# EAGLE design Adafruit-2.2-SPI-TFT-v0.2 (EAGLE 5.12)
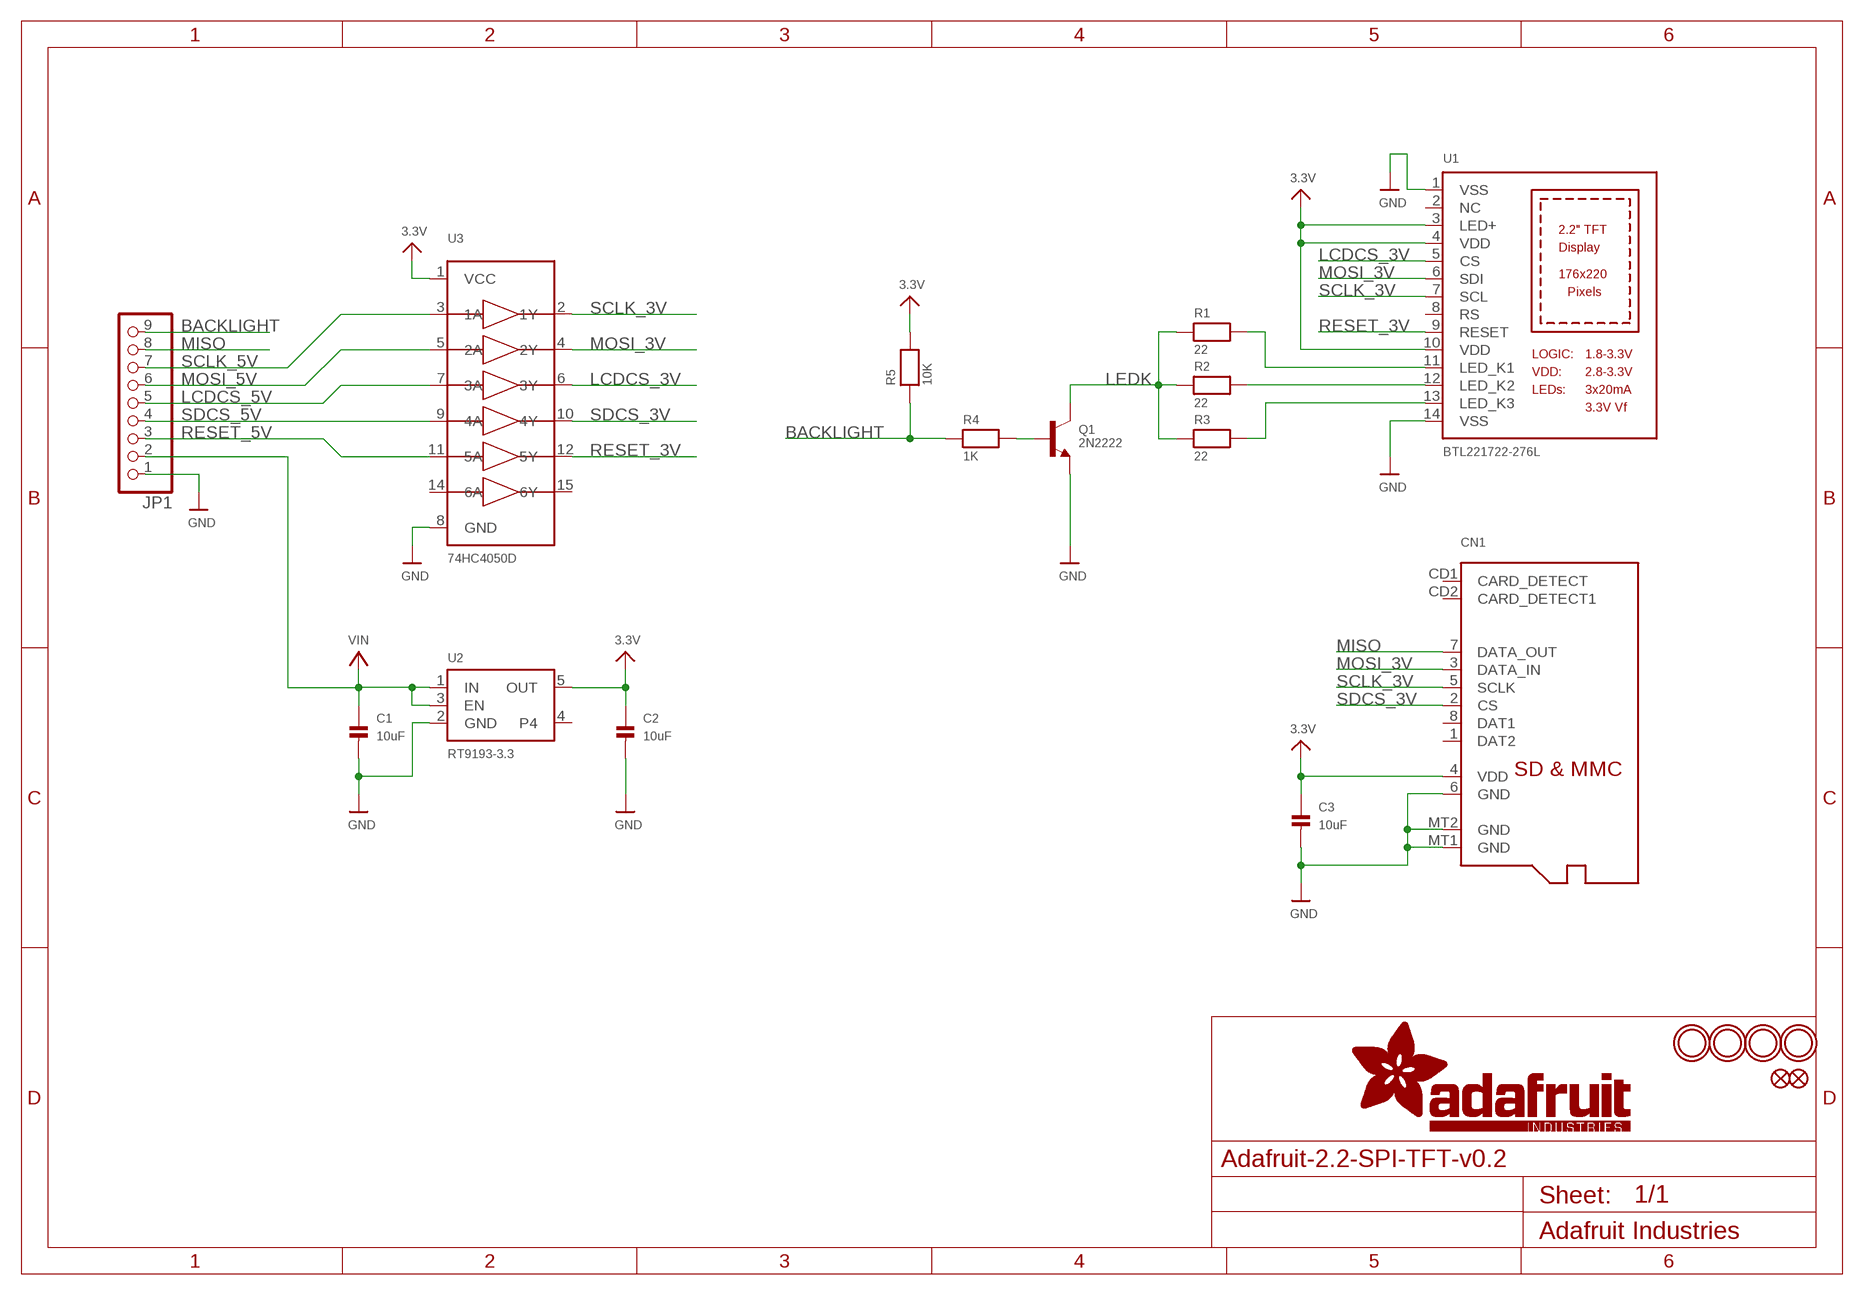
[diagram p0: schematic, sheet 1]

## Parts
C1  10uF  CAP_CERAMIC0805  [0805]
C2  10uF  CAP_CERAMIC0805  [0805]
C3  10uF  CAP_CERAMIC0805  [0805]
CN1  MICROSD  [MICROSD]
FID1  FIDUCIAL""  [FIDUCIAL_1MM]
FID2  FIDUCIAL""  [FIDUCIAL_1MM]
JP1  HEADER-1X970MIL  [1X09_ROUND_70]
Q1  2N2222  TRANSISTOR_NPNWIDE  [SOT23-WIDE]
R1  22  RESISTOR0805  [0805]
R2  22  RESISTOR0805  [0805]
R3  22  RESISTOR0805  [0805]
R4  1K  RESISTOR0805  [0805]
R5  10K  RESISTOR0805  [0805]
U1  BTL221722-276L  DISP_LCD_BTL221722-276L  [BTL221722-276L]
U2  RT9193-3.3  VREG_SOT23-5  [SOT23-5]
U3  74HC4050D  [SOIC16]
U$2  MOUNTINGHOLE2.5  [MOUNTINGHOLE_2.5_PLATED]
U$3  MOUNTINGHOLE2.5  [MOUNTINGHOLE_2.5_PLATED]
U$4  MOUNTINGHOLE2.5  [MOUNTINGHOLE_2.5_PLATED]
U$5  MOUNTINGHOLE2.5  [MOUNTINGHOLE_2.5_PLATED]

## Nets
3.3V: C2.1 C3.1 CN1.4(VDD) R5.2 U1.3(LED+) U1.4(VDD) U1.10(VDD) U2.5(OUT) U3.1(VCC)
BACKLIGHT: JP1.9 R4.1 R5.1
GND: C1.2 C2.2 C3.2 CN1.6(GND) CN1.MT1(GND) CN1.MT2(GND) JP1.1 Q1.2(E) U1.1(VSS) U1.14(VSS) U2.2(GND) U3.8(GND)
LCDCS_3V: U1.5(CS) U3.6(3Y)
LCDCS_5V: JP1.5 U3.7(3A)
LEDK: Q1.3(C) R1.1 R2.1 R3.1
MISO: CN1.7(DATA_OUT) JP1.8
MOSI_3V: CN1.3(DATA_IN) U1.6(SDI) U3.4(2Y)
MOSI_5V: JP1.6 U3.5(2A)
N$1: R1.2 U1.11(LED_K1)
N$2: R2.2 U1.12(LED_K2)
N$3: R3.2 U1.13(LED_K3)
N$4: Q1.1(B) R4.2
RESET_3V: U1.9(RESET) U3.12(5Y)
RESET_5V: JP1.3 U3.11(5A)
SCLK_3V: CN1.5(SCLK) U1.7(SCL) U3.2(1Y)
SCLK_5V: JP1.7 U3.3(1A)
SDCS_3V: CN1.2(CS) U3.10(4Y)
SDCS_5V: JP1.4 U3.9(4A)
VIN: C1.1 JP1.2 U2.1(IN) U2.3(EN)
Unconnected: CN1.1(DAT2) CN1.8(DAT1) CN1.CD1(CARD_DETECT) CN1.CD2(CARD_DETECT1) U1.2(NC) U1.8(RS) U2.4 U3.14(6A) U3.15(6Y)

## Library data of the parts
C1-C3 = microbuilder:CAP_CERAMIC: Ceramic Capacitors 0402 - 0402 Surface Mount Capacitors 16pF 50V 5% [Digikey: 445-4899-2-ND] 18pF 50V 5% [Digikey: 490-1281-2-ND] 22pF 50V 5% [Digikey: 490-1283-2-ND] 68pF 50V 5% [Digikey: 490-1289-2-ND] 0.1uF 10V 10% [Digikey: 490-1318-2-ND] 1.0uF 6.3V 10% [Digikey: 490-1320-2-ND] 0603 - 0603 Surface Mount Capacitors 16 pF 50V 5% [Digikey: 445-5051-2-ND] 22 pF 50V [Digikey: PCC220ACVTR-ND] 33 pF 50V 5% [Digikey: 490-1415-1-ND] 56pF 50V 5% [Digikey: 490-1421-1-ND] 220pF 50V 5% [Digikey: 445-1285-1-ND] 680 pF 50V 2200 pF 50V 5% C0G [Digikey: 445-1297-1-ND] 5600 pF 100V 5% X7R [Digikey: 478-3711-1-ND] 0.1 µF 25V 10% [Digikey: PCC2277TR-ND] 0.22 µF 16V 10% X7R [Digikey: 445-1318-1-ND] 1.0 µF 25V 10% [Digikey: 445-5146-2-ND] 0603 - RF Specific 3pF 250V +/-0.1pF RF [Digikey: 712-1347-1-ND] 18 pF 250V 5% [Digikey: 478-3505-1-ND or 712-1322-1-ND] 56 pF 250V 5% C0G RF [Digikey: 490-4867-1-ND] 68 pF 250V RF [Digikey: 490-4868-1-ND] 0805 - 0805 Surface Mount Capacitors 220 pF 250V 2% RF Ceramic Capacitor [Digikey: 712-1398-1-ND] 1000 pF 50V 2% NP0 Ceramic Capacitor [Digikey: 478-3760-1-ND] 0.1 µF 25V 10% Ceramic Capacitor [Digikey: PCC1828TR-ND] 1.0 µF 16V 10% Ceramic Capacitor[Digikey: 490-1691-2-ND] 10.0 µF 10V 10% Ceramic Capacitor[Digikey: 709-1228-1-ND] 10.0 uF 16V 10% Ceramic Capacitor [Digikey: 478-5165-2-ND] 47 uF 6.3V 20% Ceramic Capacitor [Digikey: 587-1779-1-ND or 399-5506-1-ND] 1206 - 1206 Surface Mount Capacitors 47uF 10V 20% Ceramic Capacitor [Digikey: 490-5528-1-ND or 399-5508-1-ND or 445-6010-1-ND] 100uF 6.3V -20%, +80% Y5V Ceramic Capacitor (Digikey: 490-4512-1-ND, Mouser: 81-GRM31CF50J107ZE1L)
CN1 = microbuilder:MICROSD: MicroSD/Transflash Card Holder with SPI pinout 3M: 2908-05WB-M6 4UConnector: 19656 Footprint courtesy: Adafruit Industries
FID1 FID2 = microbuilder:FIDUCIAL: Fiducial Alignment Points Various fiducial points for machine vision alignment.
JP1 = microbuilder:HEADER-1X9: PIN HEADER
Q1 = microbuilder:TRANSISTOR_NPN: NPN Transistor Transistor (NPN) 500mA 45V - BC817 [Digikey: 568-1631-1-ND] Transistor (NPN) 500mA 45V - BC817,215 [Mouser: 771-BC817-T/R] SOT23-R - SOT23 footprint optimised for use with solder paste and reflow ovens. SOT23-W - SOT23 footprint optimised for hand-soldering (larger pads).
R1-R5 = microbuilder:RESISTOR: Resistors 0402 - 0402 Surface Mount Package 22 Ohm 1% 1/16W [Digikey: 311-22.0LRTR-ND] 33 Ohm 5% 1/16W 1.0K 5% 1/16W 1.5K 5% 1/16W 2.0K 1% 1/16W 10.0K 1% 1/16W [Digikey: 311-10.0KLRTR-ND] 10.0K 5% 1/16W [Digikey: RMCF0402JT10K0TR-ND] 12.1K 1% 1/16W [Digikey: 311-22.0LRTR-ND] 100.0K 5% 1/16W 0603 - 0603 Surface Mount Package 0 Ohm 1/10 Watt 1% Resistor 15 Ohm 1/10 Watt 1% Resistor 33 Ohm 1/10 Watt 1% Resistor 49.9 Ohm 1/10 Watt 1% Resistor 100 Ohm 1/10 Watt 1% Resistor 150 Ohm 1/10 Watt 1% Resistor 240 Ohm 1/10 Watt 1% Resistor 390 Ohm 1/10 Watt 1% Resistor 560 Ohm 1/10 Watt 1% Resistor 680 Ohm 1/10 Watt 1% Resistor 750 Ohm 1/10 Watt 1% Resistor 1.0K Ohm 1/10 Watt 1% Resistor 1.5K Ohm 1/10 Watt 1% Resistor 2.0K Ohm 1/10 Watt 1% Resistor 2.2K Ohm 1/10 Watt 1% Resistor 3.3K Ohm 1/10 Watt 1% Resistor 4.7K Ohm 1/10 Watt 1% Resistor 10.0K Ohm 1/10 Watt 1% Resistor 12.0K Ohm 1/10 Watt 1% Resistor 12.1K Ohm 1/10 Watt 1% Resistor 20.0K Ohm 1/10 Watt 1% Resistor 33.0K Ohm 1/10 Watt 1% Resistor 100.0K Ohm 1/10 Watt 1% Resistor 0805 - 0805 Surface Mount Package 0 Ohm 1/8 Watt 1% Resistor 33 Ohm 1/8 Watt 1% Resistor 100 Ohm 1/8 Watt 1% Resistor 150 Ohm 1/8 Watt 1% Resistor 200 Ohm 1/8 Watt 1% Resistor 240 Ohm 1/8 Watt 1% Resistor 330 Ohm 1/8 Watt 1% Resistor 390 Ohm 1/8 Watt 1% Resistor 470 Ohm 1/8 Watt 1% Resistor 1.0K Ohm 1/8 Watt 1% Resistor 1.5K Ohm 1/8 Watt 1% Resistor 2.0K Ohm 1/8 Watt 1% Resistor 4.7K Ohm 1/8 Watt 1% Resistor 5.1K Ohm 1/8 Watt 1% Resistor 5.6K Ohm 1/8 Watt 1% Resistor 10.0K Ohm 1/8 Watt 1% Resistor 22.0K Ohm 1/8 Watt 1% Resistor 33.0K Ohm 1/8 Watt 1% Resistor 100K Ohm 1/8 Watt 1% Resistor 1206 - 1206 Surface Mount Package 2012 - 2010 Surface Mount Package 0.11 Ohm 1/2 Watt 1% Resistor - Digikey: RHM.11UCT-ND
U1 = microbuilder:DISP_LCD_BTL221722-276L: BTL221722-276L - 2.2" 176x220 LCD Display - SPI Interface Dimensions: W: 40.3mm, L: 55mm, H: 2.35mm Logic: 1.8-3.3V VDD: 2.8-3.3V LEDs: 3*20mA LED Vf: ~3.3V
U2 = microbuilder:VREG_SOT23-5: SOT23-5 Fixed Voltage Regulators To better organise some of the SOT23-5 fixed voltage regulators in this library, this new part was created. Part Current Out V Out V In V Dropout Digikey Part No. ADP121 150mA 3.3V 3.4-5.5V 0.09V @ 150mA ADP121-AUJZ33R7CT-ND ADP121 150mA 3.0V 3.1-5.5V 0.09V @ 150mA ADP121-AUJZ30R7CT-ND ADP122 300mA 3.3V 3.4-5.5V 0.085V @ 300mA ADP122AUJZ-3.3-R7CT-ND ADP1712 300mA 3.3V 3.5-5.5V 0.17V @ 300mA ADP1712AUJZ-3.3-R7TR-ND AP7311 (Low Cost) 150mA 3.3V 3.5-6V 0.15V @ 150mA AP7311-33WG-7DICT-ND LD39015M18R 150mA 1.8V 1.9V-5.5V 0.08V @ 100mA 497-6977-1-ND MCP1824T-3302E/OT 300mA 3.3V 3.5V-6V 0.2V @ 300mA MCP1824T-3302E/OTCT-ND MIC5205-2.5YM5 TR 150mA 2.5V 2.7-16V 0.165V @ 150mA 576-1257-2-ND MIC5205-3.0YM5 TR 150mA 3.0V 3.2V-16V 0.165V @ 150mA 576-1258-2-ND MIC5205-3.3YM5 TR 150mA 3.3V 3.5V-16V 0.165V @ 150mA 576-1259-2-ND TPS780330220 150mA 3.3V+2.2V 3.6-5.5V 250mV Max 296-23332-1-ND TDA3663/N1,135 100mA 3.3V 3.5-45V 0.18V @ 50mA 568-5343-1-ND
U3 = microbuilder:74HC4050D: 6-channel level shifter 74HC4050D - 2V-6V Supply Digikey: 74HC4050D,653-ND Mouser: 771-74HC4050D-T
U$2-U$5 = microbuilder:MOUNTINGHOLE: Mounting Hole For #2 screws (0.086"/2.18mm width, 0.094"/2.4mm hole) use 2.5mm

## Board
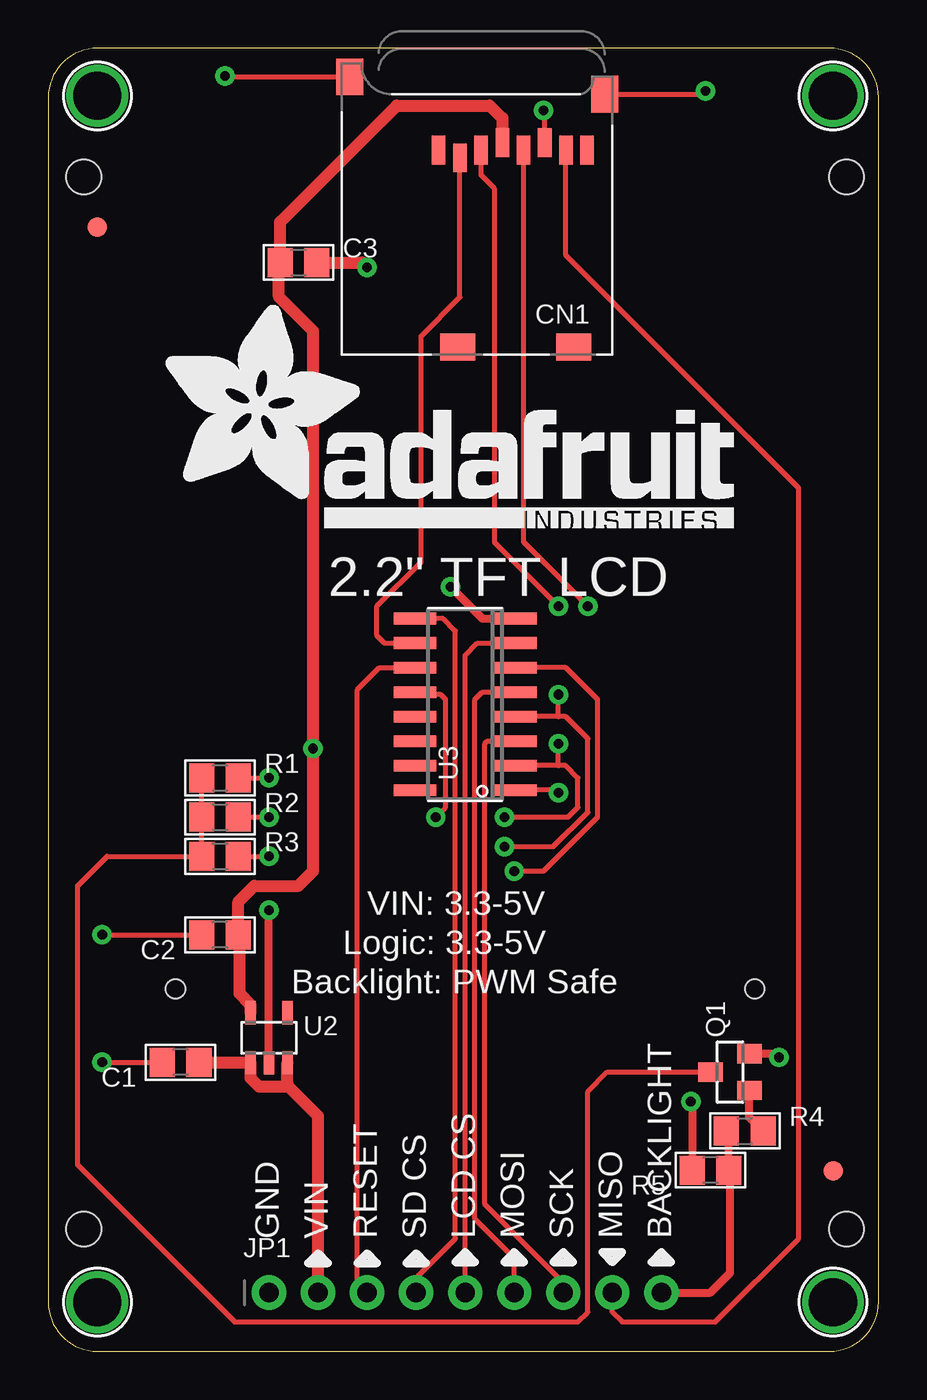
[diagram p1: board, top side]
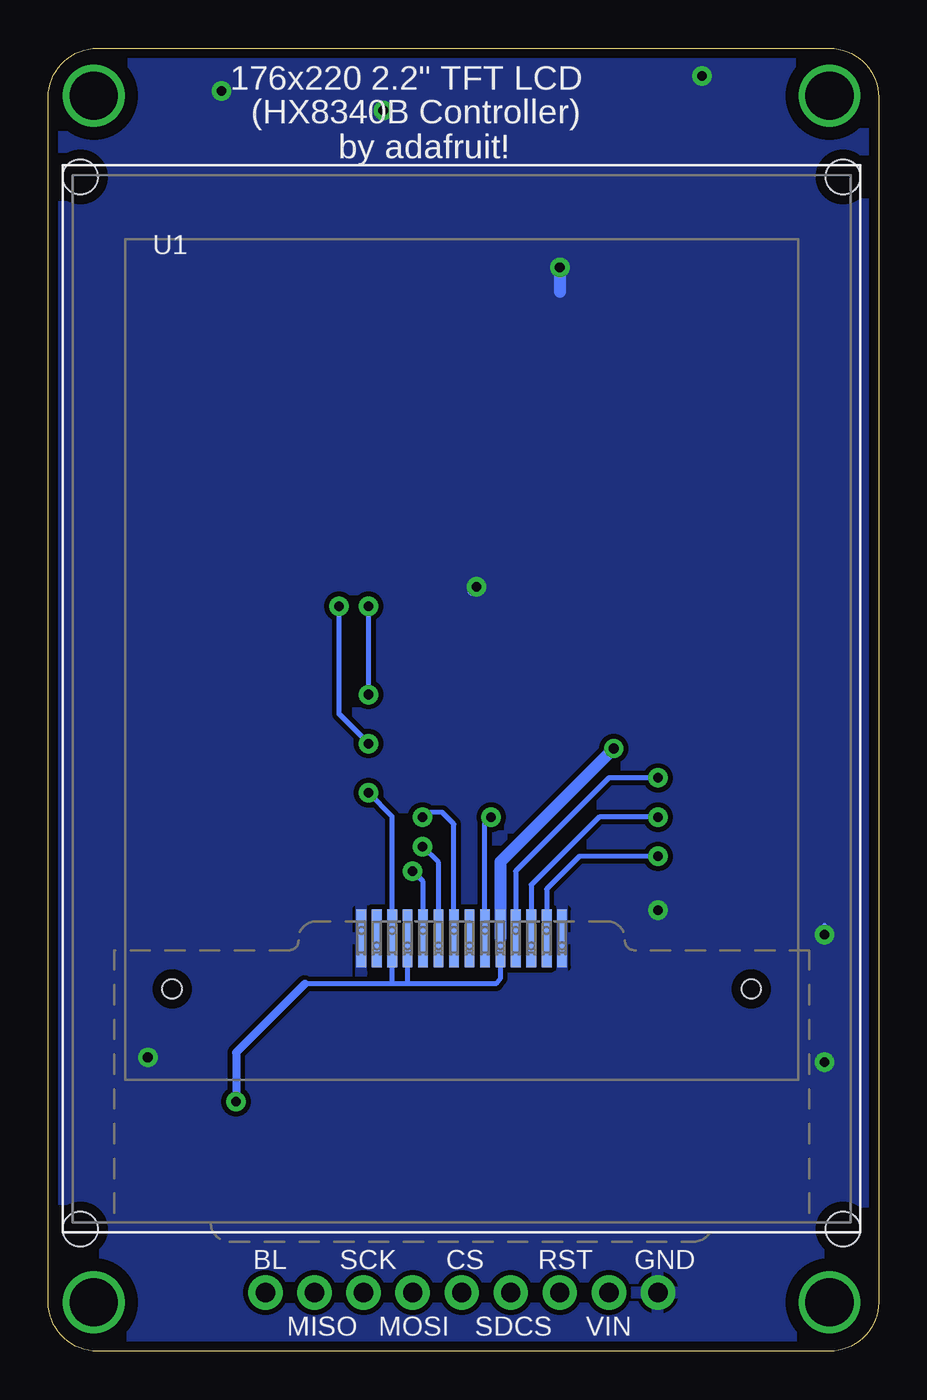
[diagram p2: board, bottom side, seen from below]

Size 43 x 67.5 mm. Coordinates in mm from the lower left corner, seen from the top.
Outline: 0,2.54 arc90 2.54,0 40.46,0 arc90 43,2.54 43,64.96 arc90 40.46,67.5 2.54,67.5 arc90 0,64.96 0,2.54
Copper layers (1*16): Top 0.035mm / dielectric 1.5mm / Bottom 0.035mm
Design rules "PCBCart-Standard": minimum track width 8mil, minimum drill 0.4mm, track to track 8mil, track to pad 8mil, pad to pad 8mil, via to via 8mil, smd to smd 8mil, copper to edge 20mil, drill to drill 8mil, minimum pad ring 8mil, minimum via ring 10mil, stop-mask expansion 3mil, vias tented up to drill 20mil, thermal gap 8mil

### Footprints (pad centres in the part's own frame; a part is rotated, then mirrored left to right if it is on the bottom)
0805 = smd 1.3 x 1.5: 1 -0.95,0; 2 0.95,0
MICROSD = smd 0.7 x 1.5: 1 9,-10.64; 2 7.9,-10.24; 3 6.8,-10.64; 4 5.7,-11.04; 5 4.6,-10.64; 6 3.5,-11.04; 7 2.4,-10.64; 8 1.3,-10.64 | smd 1.8 x 1.4: CD1 2,-0.44; CD2 8,-0.44 | smd 1.4 x 1.9: MT1 0.4,-13.54; MT2 13.6,-14.44
FIDUCIAL_1MM = smd 1 x 1: 1 0,0
1X09_ROUND_70 = drill 1 pad 1.778 round: 1 -10.16,0; 2 -7.62,0; 3 -5.08,0; 4 -2.54,0; 5 0,0; 6 2.54,0; 7 5.08,0; 8 7.62,0; 9 10.16,0
SOT23-WIDE = smd 1 x 1.27: 1 -0.95,-1; 2 0.95,-1; 3 0,1
BTL221722-276L = smd 0.5 x 3: 1 -5.2,-16.44; 2 -4.4,-16.44; 3 -3.6,-16.44; 4 -2.8,-16.44; 5 -2,-16.44; 6 -1.2,-16.44; 7 -0.4,-16.44; 8 0.4,-16.44; 9 1.2,-16.44; 10 2,-16.44; 11 2.8,-16.44; 12 3.6,-16.44; 13 4.4,-16.44; 14 5.2,-16.44 | hole 1: -15,-19.06; 15,-19.06 | hole 1.8: -19.75,-31.5; 19.75,-31.5; 19.75,23; -19.75,23
SOT23-5 = smd 0.55 x 1.2: 1 -0.95,-1.3; 2 0,-1.3; 3 0.95,-1.3; 4 0.95,1.3; 5 -0.95,1.3
SOIC16 = smd 0.6 x 2.2: 1 -4.445,-2.6; 2 -3.175,-2.6; 3 -1.905,-2.6; 4 -0.635,-2.6; 5 0.635,-2.6; 6 1.905,-2.6; 7 3.175,-2.6; 8 4.445,-2.6; 9 4.445,2.6; 10 3.175,2.6; 11 1.905,2.6; 12 0.635,2.6; 13 -0.635,2.6; 14 -1.905,2.6; 15 -3.175,2.6; 16 -4.445,2.6
MOUNTINGHOLE_2.5_PLATED = drill 2.5 pad 3.2 round: P$1 0,0

### Placement (x,y rotation side)
C1  6.86,14.97 180 top
C2  8.89,21.57 180 top
C3  12.95,56.4 0 top
CN1  29.21,51.58 180 top
FID1  40.64,9.35 0 top
FID2  2.54,58.23 0 top
JP1  21.59,3.04 0 top
Q1  35.31,14.46 90 top
R1  8.89,29.7 0 top
R2  8.89,27.67 0 top
R3  8.89,25.64 0 top
R4  36.07,11.41 0 top
R5  34.29,9.38 180 top
U1  21.59,37.83 0 bottom
U2  11.43,16.24 0 top
U3  21.59,33.51 90 top
U$2  2.54,2.54 0 top
U$3  40.64,65.04 0 top
U$4  2.54,65.04 0 top
U$5  40.64,2.54 0 top
U$20  [ADAFRUIT_TEXT_30MM]  5.84,42.66 0 top

### Tracks (layer width: path | path; a pad name or v marks a point on that pad's centre or on a via)
3.3V  (via drill 0.5)
  Top 0.254: U3.1 26.29,29.07 v26.42,28.94
  Top 0.406: R5.2 33.34,12.87 v33.27,12.94
  Top 0.61: U2.5 10.48,17.95 9.91,18.53 9.91,21.51 C2.1 9.84,23.29 10.67,24.11 12.95,24.11 13.72,24.88 v13.72,31.23 13.72,52.85 11.94,54.63 11.94,56.34 C3.1 12,58.5 18.03,64.53 22.86,64.53 23.51,63.88 CN1.4
  Bottom 0.254: v26.42,28.94 25.19,27.71 U1.3 25.19,19.08 25.15,19.03 | U1.4 24.39,19.04 24.38,19.03 | 24.38,19.03 19.81,19.03 19.59,19.32 U1.10 | 24.38,19.03 25.15,19.03 | 25.15,19.03 29.72,19.03
  Bottom 0.406: v33.27,12.94 33.27,15.48 29.72,19.03
  Bottom 0.61: U1.10 19.59,25.35 v13.72,31.23
BACKLIGHT
  Top 0.406: JP1.9 34.29,3.04 35.31,4.06 35.31,9.32 R5.1 35.24,11.41 R4.1
GND  (via drill 0.5)
  Top 0.254: v2.79,14.97 C1.2 | v2.79,21.57 C2.2 | CN1.6 25.71,64.22 v25.65,64.28 | CN1.MT1 33.86,65.12 v34.04,65.29 | CN1.MT2 9.14,66.02 v9.14,66.06
  Top 0.406: U2.2 v11.43,22.84 | Q1.2 37.66,15.41 v37.85,15.22 | U3.8 22.48,37.96 v20.83,39.61
  Top 0.61: C3.2 16.26,56.4 v16.51,56.15
  Bottom 0.254: v2.79,14.97 2.79,15.22 | v2.79,21.57 2.79,22.08 | v25.65,64.28 25.65,64.53
  Bottom 0.406: v11.43,22.84 11.43,23.1 | v37.85,15.22 38.1,15.22 | v20.83,39.61 21.08,39.35
  Bottom 0.61: v16.51,56.15 16.51,54.88
  pour Bottom (isolate 0.254): 0,0 0,67.5 43,67.5 43,0
LCDCS_3V  (via drill 0.5)
  Top 0.254: v24.13,24.88 25.65,24.88 28.45,27.67 28.45,33.77 26.8,35.42 U3.6
  Bottom 0.254: U1.5 23.59,24.34 v24.13,24.88
LCDCS_5V
  Top 0.254: JP1.5 21.59,36.05 22.23,36.69 U3.7
LEDK
  Top 0.254: Q1.3 28.96,14.46 27.94,13.45 27.94,2.02 27.43,1.52 9.65,1.52 1.52,9.64 1.52,24.11 3.05,25.64 R3.1 R2.1 R1.1
MISO
  Top 0.254: JP1.8 29.21,2.02 29.72,1.52 34.54,1.52 38.86,5.83 38.86,44.72 26.81,56.77 CN1.7
MOSI_3V  (via drill 0.5)
  Top 0.254: v23.62,26.15 26.16,26.15 27.94,27.92 27.94,31.73 26.8,32.88 26.42,32.88 | 26.42,32.88 U3.4 | CN1.3 22.41,60.92 23.11,60.21 23.11,41.89 v26.42,38.59 | 26.42,32.88 v26.42,34.02
  Bottom 0.254: U1.6 22.79,25.31 v23.62,26.15 | v26.42,34.02 v26.42,38.59
MOSI_5V
  Top 0.254: JP1.6 24.13,4.82 22.1,6.85 22.1,33.77 22.48,34.15 U3.5
N$1  (via drill 0.5)
  Top 0.254: R1.2 v11.43,29.7
  Bottom 0.254: U1.11 18.8,24.88 13.97,29.7 v11.43,29.7
N$2  (via drill 0.5)
  Top 0.254: R2.2 v11.43,27.67
  Bottom 0.254: U1.12 17.99,24.16 14.48,27.67 v11.43,27.67
N$3  (via drill 0.5)
  Top 0.254: R3.2 v11.43,25.64
  Bottom 0.254: U1.13 17.19,23.94 15.49,25.64 v11.43,25.64
N$4
  Top 0.406: Q1.1 36.31,12.13 R4.2
RESET_3V  (via drill 0.5)
  Top 0.254: v20.07,27.67 20.57,28.18 20.57,33.77 20.32,34.02 20.07,34.02 19.94,34.15 U3.12
  Bottom 0.254: U1.9 20.39,27.35 v20.07,27.67
RESET_5V
  Top 0.254: JP1.3 16,3.55 16,34.27 17.14,35.42 U3.11
SCLK_3V  (via drill 0.5)
  Top 0.254: v23.62,27.67 26.92,27.67 27.43,28.18 27.43,29.7 26.8,30.34 26.42,30.34 | 26.42,30.34 U3.2 | CN1.5 24.61,41.92 v27.94,38.59 | 26.42,30.34 v26.42,31.48
  Bottom 0.254: U1.7 21.99,27.31 22.61,27.92 23.37,27.92 v23.62,27.67 | v27.94,38.59 27.94,33 v26.42,31.48
SCLK_5V
  Top 0.254: U3.3 22.73,31.61 22.61,31.48 22.61,7.62 26.67,3.56 JP1.7
SDCS_3V
  Top 0.254: CN1.2 21.31,54.6 19.3,52.59 19.3,40.88 17.02,38.59 17.02,37.07 17.4,36.69 U3.10
SDCS_5V
  Top 0.254: JP1.4 19.05,3.8 21.08,5.83 21.08,37.32 20.45,37.96 U3.9
VIN
  Top 0.61: JP1.2 13.97,12.18 12.45,13.7 12.19,13.7 | 12.19,13.7 10.92,13.7 10.48,14.14 U2.1 7.97,14.94 C1.1 | U2.3 12.38,13.89 12.19,13.7

### Text on the board
tPlace: 2.2" TFT LCD | VIN: 3.3-5V | Logic: 3.3-5V | Backlight: PWM Safe | GND | VIN | RESET | SD CS | LCD CS | MOSI | SCK | MISO | BACKLIGHT
bPlace: 176x220 2.2" TFT LCD | (HX8340B Controller) | by adafruit! | GND | RST | CS | SCK | BL | VIN | SDCS | MOSI | MISO